# EAGLE schematic test5 (EAGLE 8.6.3)

## Sheet 1 of 3
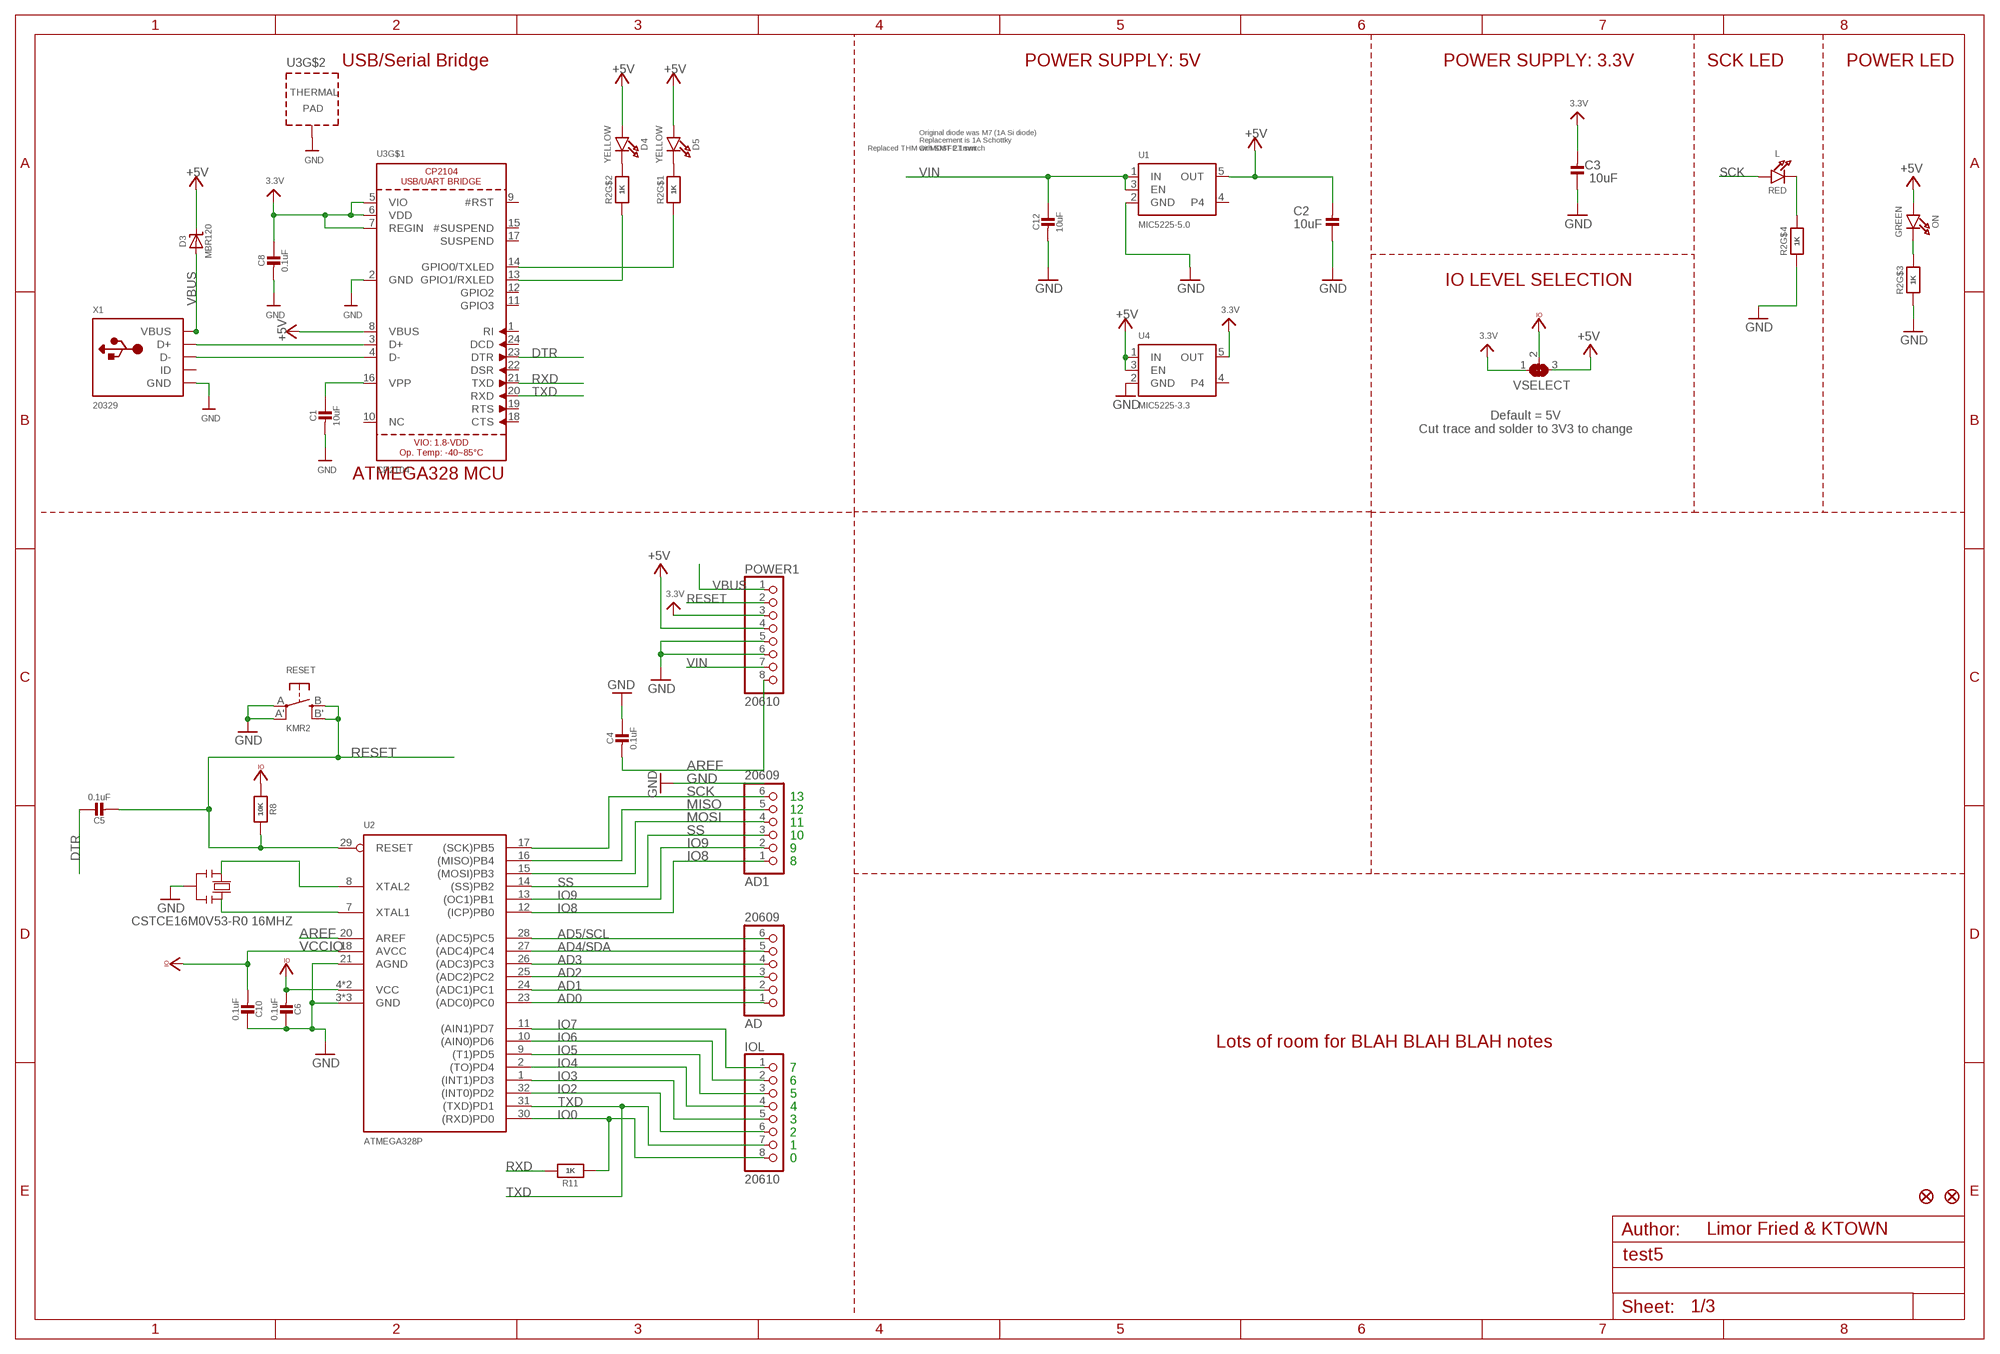
[diagram p0: schematic, sheet 1]

### Parts
AD  20609  HEADER-1X6ROUND  [1X06_ROUND]
AD1  20609  HEADER-1X6ROUND  [1X06_ROUND]
C1  10uF  CAP_CERAMIC0805-NOOUTLINE  [0805-NO]
C2  10uF  CAP_CERAMIC0805-NOOUTLINE  [0805-NO]
C3  10uF  CAP_CERAMIC0805-NOOUTLINE  [0805-NO]
C4  0.1uF  CAP_CERAMIC0805-NOOUTLINE  [0805-NO]
C5  0.1uF  CAP_CERAMIC_0805MP  [_0805MP]
C6  0.1uF  CAP_CERAMIC0805-NOOUTLINE  [0805-NO]
C8  0.1uF  CAP_CERAMIC0805-NOOUTLINE  [0805-NO]
C10  0.1uF  CAP_CERAMIC0805-NOOUTLINE  [0805-NO]
C12  10uF  CAP_CERAMIC0805-NOOUTLINE  [0805-NO]
D3  MBR120  DIODE-SCHOTTKYSOD-123  [SOD-123]
D4  YELLOW  LED0805_NOOUTLINE  [CHIPLED_0805_NOOUTLINE]
D5  YELLOW  LED0805_NOOUTLINE  [CHIPLED_0805_NOOUTLINE]
FD1  FIDUCIAL""  [FIDUCIAL_1MM]
FD2  FIDUCIAL""  [FIDUCIAL_1MM]
IOL  20610  HEADER-1X8ROUND  [1X08_ROUND]
L  RED  LED0805_NOOUTLINE  [CHIPLED_0805_NOOUTLINE]
ON  GREEN  LED0805_NOOUTLINE  [CHIPLED_0805_NOOUTLINE]
POWER1  20610  HEADER-1X870MIL  [1X08_ROUND_70]
R2  1K  RESISTOR_4PACK  [RESPACK_4X0603]
R8  10K  RESISTOR0805_NOOUTLINE  [0805-NO]
R11  1K  RESISTOR0805_NOOUTLINE  [0805-NO]
RESET  KMR2  SWITCH_TACT_SMT4.6X2.8  [BTN_KMR2_4.6X2.8]
U1  MIC5225-5.0  VREG_SOT23-5  [SOT23-5]
U2  ATMEGA328P  [MLF32-TH]
U3  CP2104  [QFN24_4MM_SMSC]
U4  MIC5225-3.3  VREG_SOT23-5  [SOT23-5]
VSELECT  SOLDERJUMPER_2WAY  [SOLDERJUMPER_2WAY_OPEN_NOPASTE]
X1  20329  USB_MICRO_20329_V2  [4UCONN_20329_V2]
Y2  CSTCE16M0V53-R0 16MHZ  RESONATORMU  [RESONATOR]

### Nets
3.3V: C3.2 C8.1 POWER1.3 U3.5(VIO) U3.6(VDD) U3.7(REGIN) U4.5(OUT) VSELECT.1
+5V [usbvcc]: C2.2 D3.C D4.A D5.A ON.A POWER1.4 U1.5(OUT) U3.8(VBUS) U4.1(IN) U4.3(EN) VSELECT.3 ; also sheet 2
AD0: AD.1 U2.23((ADC0)PC0)
AD1: AD.2 U2.24((ADC1)PC1)
AD2: AD.3 U2.25((ADC2)PC2)
AD3: AD.4 U2.26((ADC3)PC3)
AD4/SDA: AD.5 U2.27((ADC4)PC4)
AD5/SCL: AD.6 U2.28((ADC5)PC5)
AREF [aref]: C4.2 POWER1.8 U2.20(AREF)
DTR: C5.1 U3.23(DTR)
GND [gnd]: C1.2 C2.1 C3.1 C4.1 C6.1 C8.2 C10.1 C12.2 POWER1.5 POWER1.6 R2.3 R2.4 RESET.A'(P1) RESET.A(P) U1.2(GND) U2.3(GND) U2.5(GND) U2.21(AGND) U2.TH(GND) U3.2(GND) U3.THERM(TP) U4.2(GND) X1.BASE@1(GND) X1.BASE@2(GND) X1.GND X1.SPRT@1(GND) X1.SPRT@2(GND) X1.SPRT@3(GND) X1.SPRT@4(GND) Y2.2 ; also sheet 2
IO0: IOL.8 R11.1 U2.30((RXD)PD0)
IO2: IOL.6 U2.32((INT0)PD2)
IO3: IOL.5 U2.1((INT1)PD3)
IO4: IOL.4 U2.2((TO)PD4)
IO5: IOL.3 U2.9((T1)PD5)
IO6: IOL.2 U2.10((AIN0)PD6)
IO7: IOL.1 U2.11((AIN1)PD7)
IO8: AD1.1 U2.12((ICP)PB0)
IO9: AD1.2 U2.13((OC1)PB1)
MISO: AD1.5 U2.16((MISO)PB4)
MOSI: AD1.4 U2.15((MOSI)PB3)
N$1: L.C R2.5
N$3: ON.C R2.6
N$4: R2.1 U3.14(GPIO0/TXLED)
N$6: D4.C R2.7
N$7: D5.C R2.8
N$8: U3.3(D+) X1.D+
N$11: U3.4(D-) X1.D-
N$12: C1.1 U3.16(VPP)
N$15: R2.2 U3.13(GPIO1/RXLED)
RESET: C5.2 POWER1.2 R8.1 RESET.B'(S1) RESET.B(S) U2.29(RESET)
RXD: R11.2 U3.21(TXD)
SCK: AD1.6 L.A U2.17((SCK)PB5)
SS: AD1.3 U2.14((SS)PB2)
TXD: IOL.7 U2.31((TXD)PD1) U3.20(RXD)
VBUS: D3.A POWER1.1 X1.VBUS
VCCIO [usbvcc]: C6.2 C10.2 R8.2 U2.4(VCC) U2.6(VCC) U2.18(AVCC) VSELECT.2
VIN [power]: C12.1 POWER1.7 U1.1(IN) U1.3(EN)
XTAL1: U2.7(XTAL1) Y2.3
XTAL2: U2.8(XTAL2) Y2.1
Unconnected: U1.4 U3.1(RI) U3.9(#RST) U3.10(NC) U3.11(GPIO3) U3.12(GPIO2) U3.15(#SUSPEND) U3.17(SUSPEND) U3.18(CTS) U3.19(RTS) U3.22(DSR) U3.24(DCD) U4.4 X1.ID

### Notes on the sheet
- USB/Serial Bridge | POWER SUPPLY: 5V | POWER SUPPLY: 3.3V | SCK LED | POWER LED
- Replaced THM with SMT 2.1mm
- Original diode was M7 (1A Si diode)
  Replacement is 1A Schottky
  Or MOSFET switch
- IO LEVEL SELECTION
- Default = 5V
  Cut trace and solder to 3V3 to change
- ATMEGA328 MCU
- 13
- 12
- 11
- 10
- 9
- 8
- Lots of room for BLAH BLAH BLAH notes
- 7
- 6
- 5
- 4
- 3
- 2
- 1
- 0
- Limor Fried & KTOWN

## Sheet 2 of 3
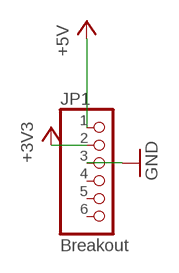
[diagram p1: schematic, sheet 2]

### Parts
JP1  Breakout  HEADER-1X676MIL  [1X06_ROUND_76]

### Nets
+3V3: JP1.2
+5V [usbvcc]: JP1.1 ; also sheet 1
GND [gnd]: JP1.3 ; also sheet 1
Unconnected: JP1.4 JP1.5 JP1.6

## Sheet 3 of 3
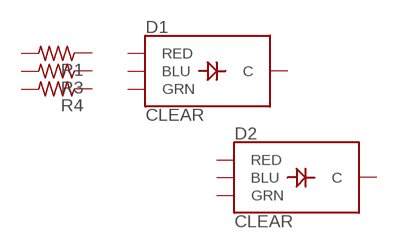
[diagram p2: schematic, sheet 3]

### Parts
D1  CLEAR  LED-RGB-CCCLEAR  [LED-RGB-THRU]
D2  CLEAR  LED-RGB-CCCLEAR  [LED-RGB-THRU]
R1  R-US_0309/12  [0309/12]
R3  R-US_0309/12  [0309/12]
R4  R-US_0309/12  [0309/12]
Unconnected: D1.1(RED) D1.2(C) D1.3(GRN) D1.4(BLU) D2.1(RED) D2.2(C) D2.3(GRN) D2.4(BLU) R1.1 R1.2 R3.1 R3.2 R4.1 R4.2

## Library data of the parts
AD AD1 JP1 = microbuilder:HEADER-1X6: PIN HEADER
C1-C6 C8 C10 C12 = microbuilder:CAP_CERAMIC: Ceramic Capacitors For new designs, use the packages preceded by an '_' character since they are more reliable: The following footprints should be used on most boards: _0402 - Standard footprint for regular board layouts _0603 - Standard footprint for regular board layouts _0805 - Standard footprint for regular board layouts _1206 - Standard footprint for regular board layouts For extremely tight-pitch boards where space is at a premium, the following 'micro-pitch' footprints can be used (smaller pads, no silkscreen outline, etc.): _0402MP - Micro-pitch footprint for very dense/compact boards _0603MP - Micro-pitch footprint for very dense/compact boards _0805MP - Micro-pitch footprint for very dense/compact boards _1206MP - Micro-pitch footprint for very dense/compact boards
D1 D2 = SparkFun-LED:LED-RGB-CC: LED-RGB Common Cathode Packages: LED RGB-THRU LED_PIRANHA_5MM SparkFun Products: RGB Diffused Common Cathode- Diffuse <[https://www.sparkfun.com/products/9264]> RGB Diffused Common Cathode - Clear <[https://www.sparkfun.com/products/105]> LED-RGB 5mm Square (Piranha) <[https://www.sparkfun.com/products/11679]>; PROD_ID: DIO-08418
D3 = microbuilder:DIODE-SCHOTTKY
D4 D5 L ON = microbuilder:LED: LED 0603 - 0603 Surface Mount Package 2mA: Green LED - Low Power (3.9mcd, 2ma, 1.7Vf) - Digikey: 475-2709-2-ND Orange LED - Low Power (9.8mcd, 2ma, 1.8Vf) - Digikey: 475-1194-2-ND Red LED - Low Power (5mcd, 2ma, 1.8Vf) - Digikey: 475-1195-2-ND Yellow LED - Low Power (7mcd, 2ma, 1.8Vf) - Digikey: 475-1196-2-ND 5mA: Blue LED - Low Power (17mcd, 5ma, 2.9Vf) - Digikey: LNJ937W8CRACT-ND 0805 - 0805 Surface Mount Package 2mA: Red LED (8.8mcd, 2mA, 1.8Vf, Clear) - Low Power [Digikey: 475-2510-1-ND] Green LED (5mcd, 2mA, 1.8Vf, Clear) - Low Power [Digikey: 475-2730-1-ND] Yellow LED (11.3mcd, 2mA, 1.8Vf, Clear) - Low Power [Digikey: 475-2555-1-ND] 20mA: Red LED (104mcd, 20mA, Diffused) - LS R976 [Digikey: 475-1278-6-ND] Red LED (12mcd, 20mA, 2.0Vf, Clear) - APT2012EC [Digikey: 754-1128-1-ND] Green LED (15mcd, 20mA, 2.2Vf, Clear) - APT2012GC [Digikey: 754-1131-1-ND] Orange LED (160mcd, 20mA, 2.1Vf, Clear) - APT2012SECK [Digikey: 754-1130-1-ND] 1206 - 1206 Surface Mount Package Green LED (26mcd, 20mA, Diffused) - LG N971 [Digikey: 475-1407-6-ND] Red LED (15mcd, 20mA, Diffused) - LH N974 [Digikey: 475-1416-6-ND] Cree - Cree High-Power Surface Mount LEDs XPEBWT-L1-0000-00D50 - White 111lm 350mA 2.9Vf 6200K 110° XTEAWT-00-0000-00000LEE3 - White 114lm 350mA 2.85Vf 5000K 115° Everlight - Everlight 45-21 Series Surface Mount LEDs 45-21/QK2C-B2832AC2CB2/2T - Warm White 2000mcd 20mA 3.25Vf 3050K 120° 45-21/LK2C-B38452C4CB2/2T - Nuetral White 2000mcd 20mA 3.25Vf 4150K 120° 45-21/LK2C-B50634C6CB2/2T - Cold White 2200mcd 20mA 3.25Vf 5650K 120° PLCC2 Reverse Mount LS T77K-J1L2-1-0-2-R18-Z - Red 11.25mcd 2mA 1.8Vf 630nm 120° LO T77K-L1M2-24-Z - Orange 19.6mcd 2mA 1.8Vf 606nm 120° LY T77K-K2M1-26-Z - Yellow 15.7mcd 2mA 1.8Vf 587nm 120°
FD1 FD2 = microbuilder:FIDUCIAL: Fiducial Alignment Points Various fiducial points for machine vision alignment.; BOM: EXCLUDE
IOL POWER1 = microbuilder:HEADER-1X8: PIN HEADER
R1 R3 R4 = resistor:R-US_: RESISTOR, American symbol
R2 = microbuilder:RESISTOR_4PACK: Resistor Packs (4 resistors) 4 x 0603 10K 1/16W - Digikey: YC164J-10KCT-ND
R8 R11 = microbuilder:RESISTOR: Resistors For new designs, use the packages preceded by an '_' character since they are more reliable: The following footprints should be used on most boards: _0402 - Standard footprint for regular board layouts _0603 - Standard footprint for regular board layouts _0805 - Standard footprint for regular board layouts _1206 - Standard footprint for regular board layouts For extremely tight-pitch boards where space is at a premium, the following 'micro-pitch' footprints can be used (smaller pads, no silkscreen outline, etc.): _0402MP - Micro-pitch footprint for very dense/compact boards _0603MP - Micro-pitch footprint for very dense/compact boards _0805MP - Micro-pitch footprint for very dense/compact boards _1206MP - Micro-pitch footprint for very dense/compact boards
RESET = microbuilder:SWITCH_TACT_SMT: SMT Tact Switches 6x6mm - Digikey: P12940SCT-ND KMR2 (4.6x2.8mm) - Digikey: 401-1426-1-ND EVQ-PQHB55 - Light Touch, 160GF (4.5x4.5mm) - Digikey: P8090SCT-ND KMT0 - KMT021 NGJ LHS (etc.) IP68/Waterproof - Digikey: CKN10289CT-ND
U1 U4 = microbuilder:VREG_SOT23-5: SOT23-5 Fixed Voltage Regulators Part Current Out V Out V In V Dropout θJA (°C/W) TJ (°C) Digikey Part No. ADP121 150mA 3.3V 3.4-5.5V 0.09V @ 150mA -- -- ADP121-AUJZ33R7CT-ND ADP121 150mA 3.0V 3.1-5.5V 0.09V @ 150mA -- -- ADP121-AUJZ30R7CT-ND ADP122 300mA 3.3V 3.4-5.5V 0.085V @ 300mA -- -- ADP122AUJZ-3.3-R7CT-ND ADP1712 300mA 3.3V 3.5-5.5V 0.17V @ 300mA -- -- ADP1712AUJZ-3.3-R7TR-ND AP7311 (Low Cost) 150mA 3.3V 3.5-6V 0.15V @ 150mA -- -- AP7311-33WG-7DICT-ND LD39015M18R 150mA 1.8V 1.9V-5.5V 0.08V @ 100mA -- -- 497-6977-1-ND LP2985A-33DBVR 150mA 3.3V 3.3-16V 0.28V @ 150mA 206 150 296-18479-1-ND MCP1824T-3302E/OT 300mA 3.3V 3.5V-6V 0.2V @ 300mA -- -- MCP1824T-3302E/OTCT-ND MIC5205-2.5YM5 TR 150mA 2.5V 2.7-16V 0.165V @ 150mA -- -- 576-1257-2-ND MIC5205-3.0YM5 TR 150mA 3.0V 3.2V-16V 0.165V @ 150mA -- -- 576-1258-2-ND MIC5205-3.3YM5 TR 150mA 3.3V 3.5V-16V 0.165V @ 150mA -- -- 576-1259-2-ND TPS780330220 150mA 3.3V+2.2V 3.6-5.5V 250mV Max -- -- 296-23332-1-ND TDA3663/N1,135 100mA 3.3V 3.5-45V 0.18V @ 50mA -- -- 568-5343-1-ND Max operating temp can be calculated using θJA, TJ (max junction temperature), and power in watts. Set the "Maximum Ambient Temperature" until it reaches TJ ("Max Junction Temperature"), which is the absolute limit for safe use of the regulator: Heat Sink Temperature Calculator <http://www.daycounter.com/Calculators/Heat-Sink-Temperature-Calculator.phtml> For example, With 12V source into a 3.3V LP2985 and a 30mA load, we are dissipating (12V-3.3V) * 0.03A = 0.261W. With a θJA of 206 °C/W, a TJ of 150°C, and 261mW we can safely use the chip without a heat sink up to 75°C (=147.1°C Junction Temperature).
U2 = microbuilder:ATMEGA328P: ATMEGA 328P
U3 = microbuilder:CP2104: CP2104 - USB to UART Bridge VDD Output: 3.45V
VSELECT = microbuilder:SOLDERJUMPER_2WAY: 2-Way Solder Jumper
X1 = microbuilder:USB: USB Connectors USBMINIB - Surface Mount Female Mini-B USB Connector 4UConnector: 06564
Y2 = SmartPrj:RESONATOR

## Net classes
1 power: width 0.305 mm, drill 0.483 mm, clearance 0.203 mm
2 gnd: width 0.305 mm, drill 0.483 mm, clearance 0.203 mm
3 usbvcc: width 0.305 mm, drill 0.483 mm, clearance 0.203 mm
4 aref: width 0.254 mm, drill 0.483 mm, clearance 0.203 mm